# EAGLE design cherrymx1 (EAGLE 9.6.2)
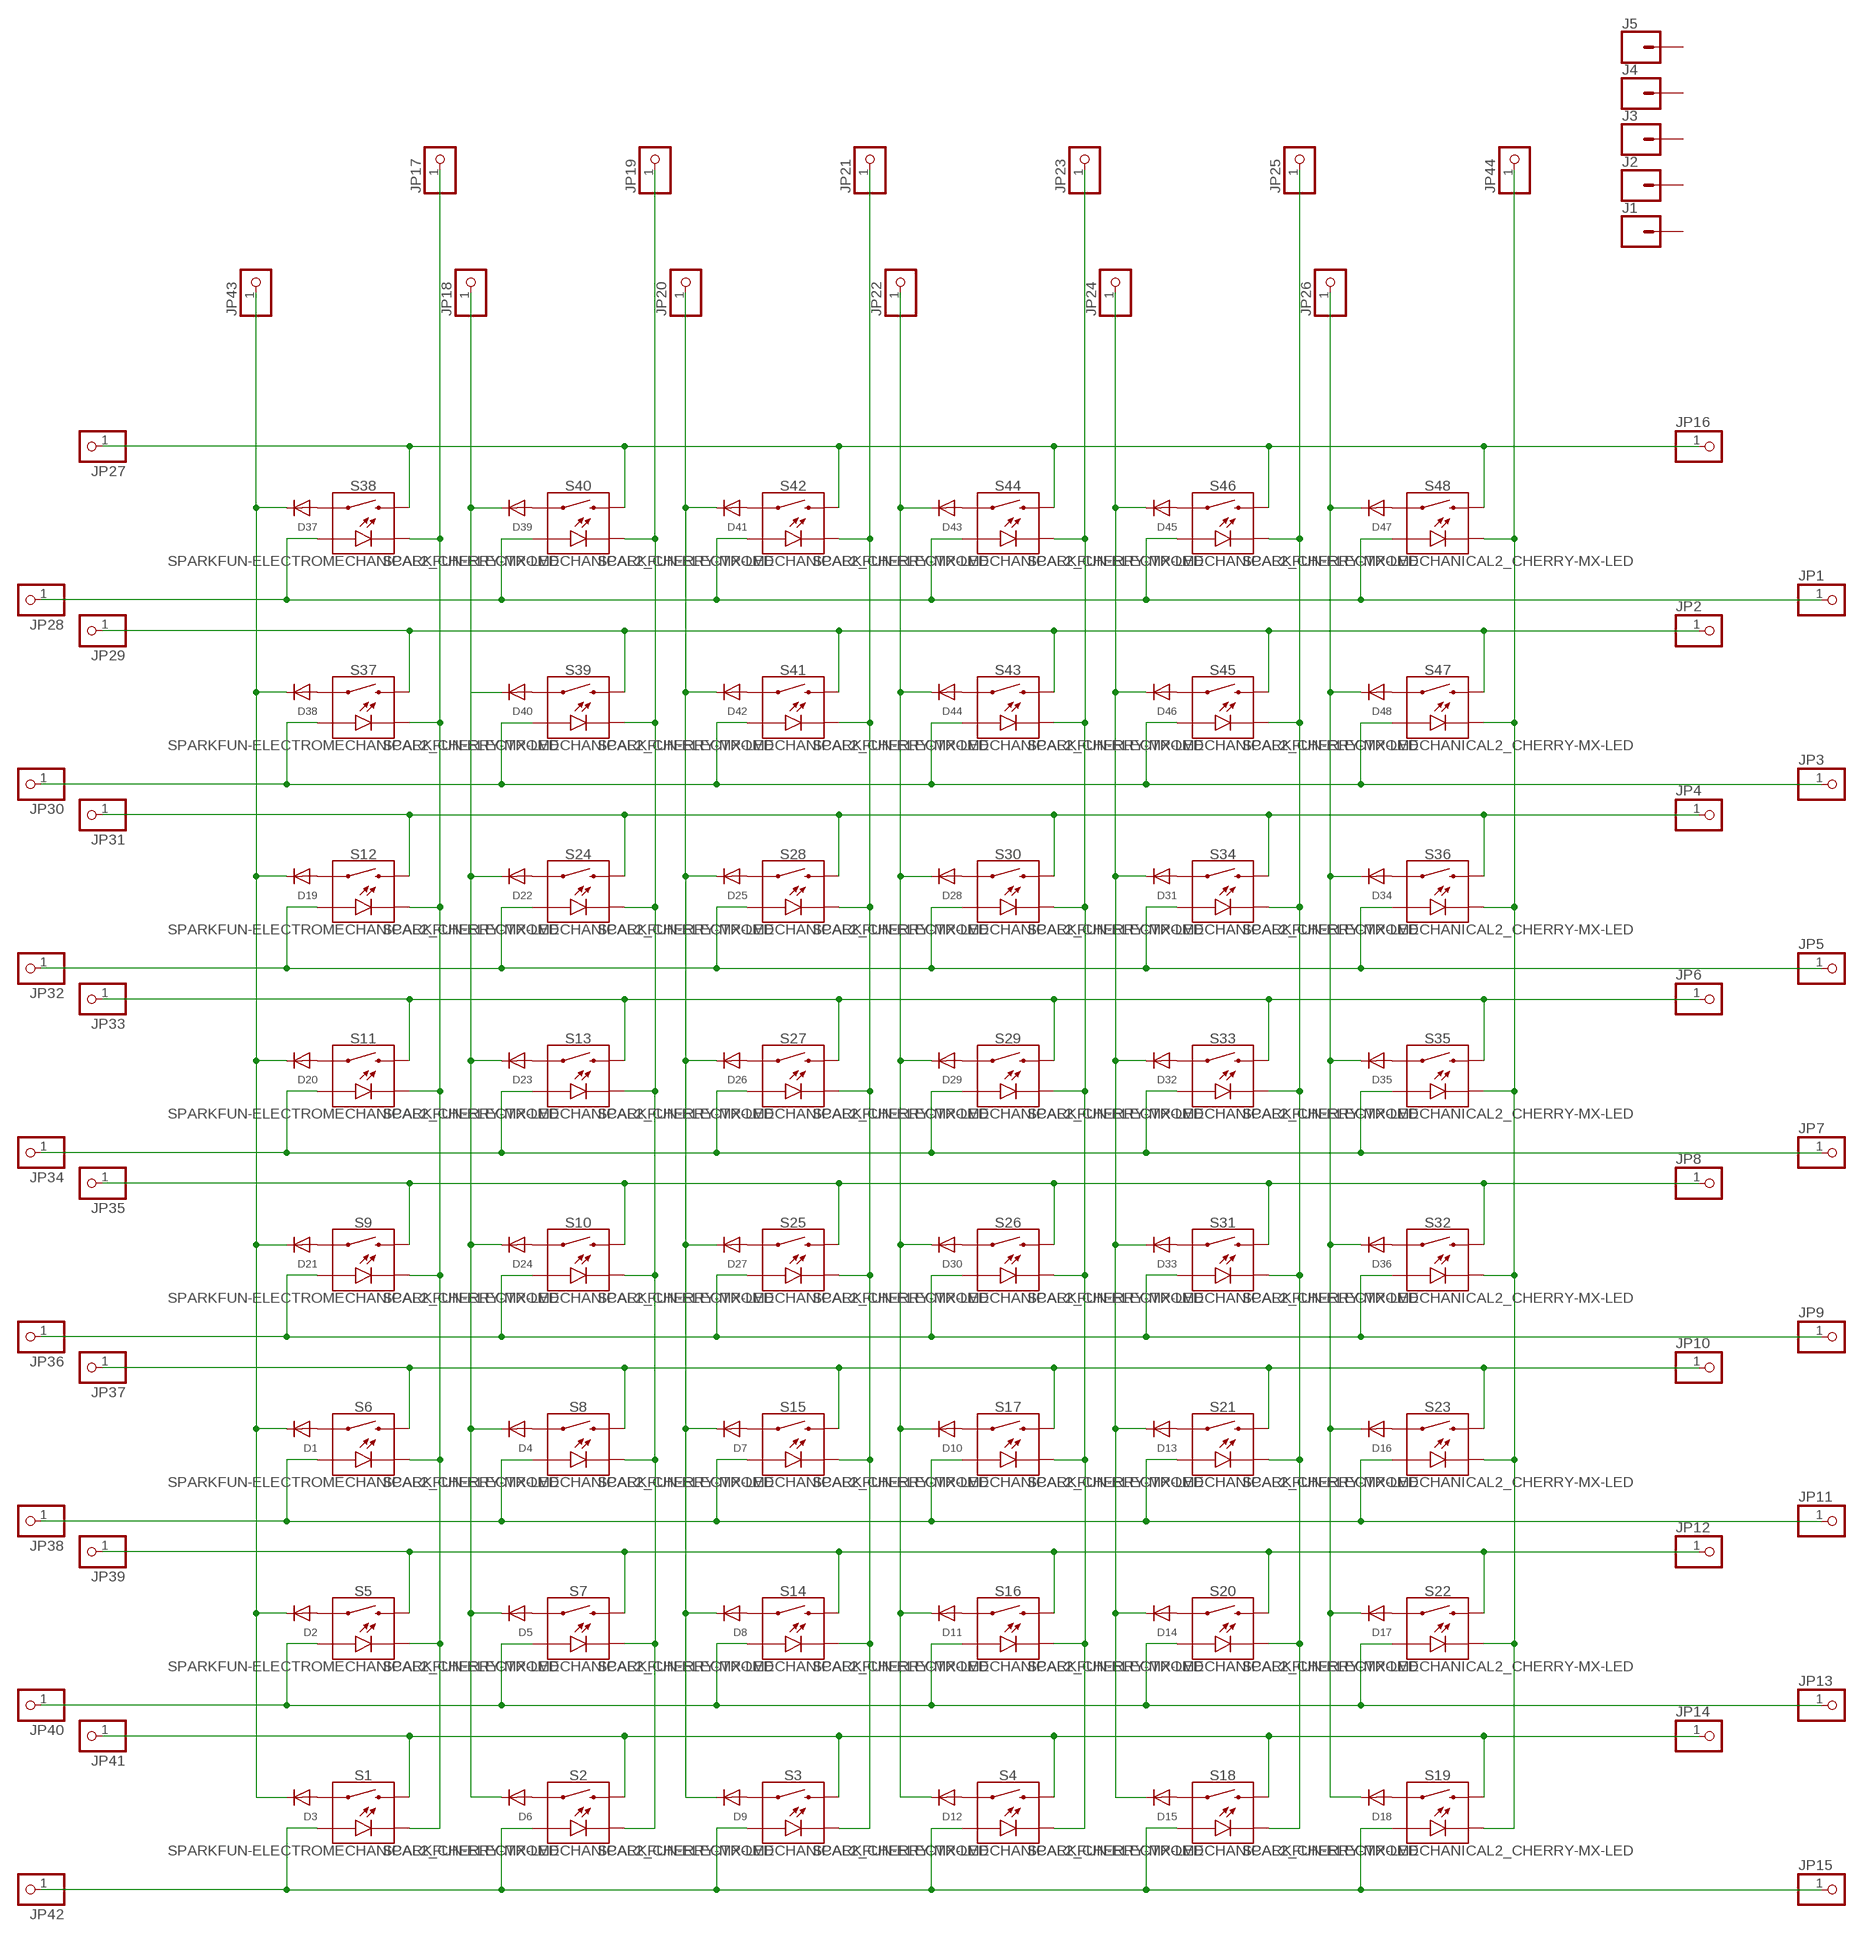
[diagram p0: schematic, sheet 1]

## Parts
D1  DIODE_SOD-123FL  [SOD-123FL]
D2  DIODE_SOD-123FL  [SOD-123FL]
D3  DIODE_SOD-123FL  [SOD-123FL]
D4  DIODE_SOD-123FL  [SOD-123FL]
D5  DIODE_SOD-123FL  [SOD-123FL]
D6  DIODE_SOD-123FL  [SOD-123FL]
D7  DIODE_SOD-123FL  [SOD-123FL]
D8  DIODE_SOD-123FL  [SOD-123FL]
D9  DIODE_SOD-123FL  [SOD-123FL]
D10  DIODE_SOD-123FL  [SOD-123FL]
D11  DIODE_SOD-123FL  [SOD-123FL]
D12  DIODE_SOD-123FL  [SOD-123FL]
D13  DIODE_SOD-123FL  [SOD-123FL]
D14  DIODE_SOD-123FL  [SOD-123FL]
D15  DIODE_SOD-123FL  [SOD-123FL]
D16  DIODE_SOD-123FL  [SOD-123FL]
D17  DIODE_SOD-123FL  [SOD-123FL]
D18  DIODE_SOD-123FL  [SOD-123FL]
D19  DIODE_SOD-123FL  [SOD-123FL]
D20  DIODE_SOD-123FL  [SOD-123FL]
D21  DIODE_SOD-123FL  [SOD-123FL]
D22  DIODE_SOD-123FL  [SOD-123FL]
D23  DIODE_SOD-123FL  [SOD-123FL]
D24  DIODE_SOD-123FL  [SOD-123FL]
D25  DIODE_SOD-123FL  [SOD-123FL]
D26  DIODE_SOD-123FL  [SOD-123FL]
D27  DIODE_SOD-123FL  [SOD-123FL]
D28  DIODE_SOD-123FL  [SOD-123FL]
D29  DIODE_SOD-123FL  [SOD-123FL]
D30  DIODE_SOD-123FL  [SOD-123FL]
D31  DIODE_SOD-123FL  [SOD-123FL]
D32  DIODE_SOD-123FL  [SOD-123FL]
D33  DIODE_SOD-123FL  [SOD-123FL]
D34  DIODE_SOD-123FL  [SOD-123FL]
D35  DIODE_SOD-123FL  [SOD-123FL]
D36  DIODE_SOD-123FL  [SOD-123FL]
D37  DIODE_SOD-123FL  [SOD-123FL]
D38  DIODE_SOD-123FL  [SOD-123FL]
D39  DIODE_SOD-123FL  [SOD-123FL]
D40  DIODE_SOD-123FL  [SOD-123FL]
D41  DIODE_SOD-123FL  [SOD-123FL]
D42  DIODE_SOD-123FL  [SOD-123FL]
D43  DIODE_SOD-123FL  [SOD-123FL]
D44  DIODE_SOD-123FL  [SOD-123FL]
D45  DIODE_SOD-123FL  [SOD-123FL]
D46  DIODE_SOD-123FL  [SOD-123FL]
D47  DIODE_SOD-123FL  [SOD-123FL]
D48  DIODE_SOD-123FL  [SOD-123FL]
J1  CONN_01SMTSO-256-ET-0.165DIA  [SMTSO-256-ET-0.165DIA]
J2  CONN_01SMTSO-256-ET-0.165DIA  [SMTSO-256-ET-0.165DIA]
J3  CONN_01SMTSO-256-ET-0.165DIA  [SMTSO-256-ET-0.165DIA]
J4  CONN_01SMTSO-256-ET-0.165DIA  [SMTSO-256-ET-0.165DIA]
J5  CONN_01SMTSO-256-ET-0.165DIA  [SMTSO-256-ET-0.165DIA]
JP1  MICROBUILDER_HEADER-1X51X1_EDGESMT  [MICROBUILDER_1X5_SMT]
JP2  MICROBUILDER_HEADER-1X51X1_EDGESMT  [MICROBUILDER_1X5_SMT]
JP3  MICROBUILDER_HEADER-1X51X1_EDGESMT  [MICROBUILDER_1X5_SMT]
JP4  MICROBUILDER_HEADER-1X51X1_EDGESMT  [MICROBUILDER_1X5_SMT]
JP5  MICROBUILDER_HEADER-1X51X1_EDGESMT  [MICROBUILDER_1X5_SMT]
JP6  MICROBUILDER_HEADER-1X51X1_EDGESMT  [MICROBUILDER_1X5_SMT]
JP7  MICROBUILDER_HEADER-1X51X1_EDGESMT  [MICROBUILDER_1X5_SMT]
JP8  MICROBUILDER_HEADER-1X51X1_EDGESMT  [MICROBUILDER_1X5_SMT]
JP9  MICROBUILDER_HEADER-1X51X1_EDGESMT  [MICROBUILDER_1X5_SMT]
JP10  MICROBUILDER_HEADER-1X51X1_EDGESMT  [MICROBUILDER_1X5_SMT]
JP11  MICROBUILDER_HEADER-1X51X1_EDGESMT  [MICROBUILDER_1X5_SMT]
JP12  MICROBUILDER_HEADER-1X51X1_EDGESMT  [MICROBUILDER_1X5_SMT]
JP13  MICROBUILDER_HEADER-1X51X1_EDGESMT  [MICROBUILDER_1X5_SMT]
JP14  MICROBUILDER_HEADER-1X51X1_EDGESMT  [MICROBUILDER_1X5_SMT]
JP15  MICROBUILDER_HEADER-1X51X1_EDGESMT  [MICROBUILDER_1X5_SMT]
JP16  MICROBUILDER_HEADER-1X51X1_EDGESMT  [MICROBUILDER_1X5_SMT]
JP17  MICROBUILDER_HEADER-1X51X1_EDGESMT  [MICROBUILDER_1X5_SMT]
JP18  MICROBUILDER_HEADER-1X51X1_EDGESMT  [MICROBUILDER_1X5_SMT]
JP19  MICROBUILDER_HEADER-1X51X1_EDGESMT  [MICROBUILDER_1X5_SMT]
JP20  MICROBUILDER_HEADER-1X51X1_EDGESMT  [MICROBUILDER_1X5_SMT]
JP21  MICROBUILDER_HEADER-1X51X1_EDGESMT  [MICROBUILDER_1X5_SMT]
JP22  MICROBUILDER_HEADER-1X51X1_EDGESMT  [MICROBUILDER_1X5_SMT]
JP23  MICROBUILDER_HEADER-1X51X1_EDGESMT  [MICROBUILDER_1X5_SMT]
JP24  MICROBUILDER_HEADER-1X51X1_EDGESMT  [MICROBUILDER_1X5_SMT]
JP25  MICROBUILDER_HEADER-1X51X1_EDGESMT  [MICROBUILDER_1X5_SMT]
JP26  MICROBUILDER_HEADER-1X51X1_EDGESMT  [MICROBUILDER_1X5_SMT]
JP27  MICROBUILDER_HEADER-1X51X1_EDGESMT  [MICROBUILDER_1X5_SMT]
JP28  MICROBUILDER_HEADER-1X51X1_EDGESMT  [MICROBUILDER_1X5_SMT]
JP29  MICROBUILDER_HEADER-1X51X1_EDGESMT  [MICROBUILDER_1X5_SMT]
JP30  MICROBUILDER_HEADER-1X51X1_EDGESMT  [MICROBUILDER_1X5_SMT]
JP31  MICROBUILDER_HEADER-1X51X1_EDGESMT  [MICROBUILDER_1X5_SMT]
JP32  MICROBUILDER_HEADER-1X51X1_EDGESMT  [MICROBUILDER_1X5_SMT]
JP33  MICROBUILDER_HEADER-1X51X1_EDGESMT  [MICROBUILDER_1X5_SMT]
JP34  MICROBUILDER_HEADER-1X51X1_EDGESMT  [MICROBUILDER_1X5_SMT]
JP35  MICROBUILDER_HEADER-1X51X1_EDGESMT  [MICROBUILDER_1X5_SMT]
JP36  MICROBUILDER_HEADER-1X51X1_EDGESMT  [MICROBUILDER_1X5_SMT]
JP37  MICROBUILDER_HEADER-1X51X1_EDGESMT  [MICROBUILDER_1X5_SMT]
JP38  MICROBUILDER_HEADER-1X51X1_EDGESMT  [MICROBUILDER_1X5_SMT]
JP39  MICROBUILDER_HEADER-1X51X1_EDGESMT  [MICROBUILDER_1X5_SMT]
JP40  MICROBUILDER_HEADER-1X51X1_EDGESMT  [MICROBUILDER_1X5_SMT]
JP41  MICROBUILDER_HEADER-1X51X1_EDGESMT  [MICROBUILDER_1X5_SMT]
JP42  MICROBUILDER_HEADER-1X51X1_EDGESMT  [MICROBUILDER_1X5_SMT]
JP43  MICROBUILDER_HEADER-1X51X1_EDGESMT  [MICROBUILDER_1X5_SMT]
JP44  MICROBUILDER_HEADER-1X51X1_EDGESMT  [MICROBUILDER_1X5_SMT]
S1  SPARKFUN-ELECTROMECHANICAL2_CHERRY-MX-LED  [SPARKFUN-ELECTROMECHANICAL2_CHERRY-MX-LED]
S2  SPARKFUN-ELECTROMECHANICAL2_CHERRY-MX-LED  [SPARKFUN-ELECTROMECHANICAL2_CHERRY-MX-LED]
S3  SPARKFUN-ELECTROMECHANICAL2_CHERRY-MX-LED  [SPARKFUN-ELECTROMECHANICAL2_CHERRY-MX-LED]
S4  SPARKFUN-ELECTROMECHANICAL2_CHERRY-MX-LED  [SPARKFUN-ELECTROMECHANICAL2_CHERRY-MX-LED]
S5  SPARKFUN-ELECTROMECHANICAL2_CHERRY-MX-LED  [SPARKFUN-ELECTROMECHANICAL2_CHERRY-MX-LED]
S6  SPARKFUN-ELECTROMECHANICAL2_CHERRY-MX-LED  [SPARKFUN-ELECTROMECHANICAL2_CHERRY-MX-LED]
S7  SPARKFUN-ELECTROMECHANICAL2_CHERRY-MX-LED  [SPARKFUN-ELECTROMECHANICAL2_CHERRY-MX-LED]
S8  SPARKFUN-ELECTROMECHANICAL2_CHERRY-MX-LED  [SPARKFUN-ELECTROMECHANICAL2_CHERRY-MX-LED]
S9  SPARKFUN-ELECTROMECHANICAL2_CHERRY-MX-LED  [SPARKFUN-ELECTROMECHANICAL2_CHERRY-MX-LED]
S10  SPARKFUN-ELECTROMECHANICAL2_CHERRY-MX-LED  [SPARKFUN-ELECTROMECHANICAL2_CHERRY-MX-LED]
S11  SPARKFUN-ELECTROMECHANICAL2_CHERRY-MX-LED  [SPARKFUN-ELECTROMECHANICAL2_CHERRY-MX-LED]
S12  SPARKFUN-ELECTROMECHANICAL2_CHERRY-MX-LED  [SPARKFUN-ELECTROMECHANICAL2_CHERRY-MX-LED]
S13  SPARKFUN-ELECTROMECHANICAL2_CHERRY-MX-LED  [SPARKFUN-ELECTROMECHANICAL2_CHERRY-MX-LED]
S14  SPARKFUN-ELECTROMECHANICAL2_CHERRY-MX-LED  [SPARKFUN-ELECTROMECHANICAL2_CHERRY-MX-LED]
S15  SPARKFUN-ELECTROMECHANICAL2_CHERRY-MX-LED  [SPARKFUN-ELECTROMECHANICAL2_CHERRY-MX-LED]
S16  SPARKFUN-ELECTROMECHANICAL2_CHERRY-MX-LED  [SPARKFUN-ELECTROMECHANICAL2_CHERRY-MX-LED]
S17  SPARKFUN-ELECTROMECHANICAL2_CHERRY-MX-LED  [SPARKFUN-ELECTROMECHANICAL2_CHERRY-MX-LED]
S18  SPARKFUN-ELECTROMECHANICAL2_CHERRY-MX-LED  [SPARKFUN-ELECTROMECHANICAL2_CHERRY-MX-LED]
S19  SPARKFUN-ELECTROMECHANICAL2_CHERRY-MX-LED  [SPARKFUN-ELECTROMECHANICAL2_CHERRY-MX-LED]
S20  SPARKFUN-ELECTROMECHANICAL2_CHERRY-MX-LED  [SPARKFUN-ELECTROMECHANICAL2_CHERRY-MX-LED]
S21  SPARKFUN-ELECTROMECHANICAL2_CHERRY-MX-LED  [SPARKFUN-ELECTROMECHANICAL2_CHERRY-MX-LED]
S22  SPARKFUN-ELECTROMECHANICAL2_CHERRY-MX-LED  [SPARKFUN-ELECTROMECHANICAL2_CHERRY-MX-LED]
S23  SPARKFUN-ELECTROMECHANICAL2_CHERRY-MX-LED  [SPARKFUN-ELECTROMECHANICAL2_CHERRY-MX-LED]
S24  SPARKFUN-ELECTROMECHANICAL2_CHERRY-MX-LED  [SPARKFUN-ELECTROMECHANICAL2_CHERRY-MX-LED]
S25  SPARKFUN-ELECTROMECHANICAL2_CHERRY-MX-LED  [SPARKFUN-ELECTROMECHANICAL2_CHERRY-MX-LED]
S26  SPARKFUN-ELECTROMECHANICAL2_CHERRY-MX-LED  [SPARKFUN-ELECTROMECHANICAL2_CHERRY-MX-LED]
S27  SPARKFUN-ELECTROMECHANICAL2_CHERRY-MX-LED  [SPARKFUN-ELECTROMECHANICAL2_CHERRY-MX-LED]
S28  SPARKFUN-ELECTROMECHANICAL2_CHERRY-MX-LED  [SPARKFUN-ELECTROMECHANICAL2_CHERRY-MX-LED]
S29  SPARKFUN-ELECTROMECHANICAL2_CHERRY-MX-LED  [SPARKFUN-ELECTROMECHANICAL2_CHERRY-MX-LED]
S30  SPARKFUN-ELECTROMECHANICAL2_CHERRY-MX-LED  [SPARKFUN-ELECTROMECHANICAL2_CHERRY-MX-LED]
S31  SPARKFUN-ELECTROMECHANICAL2_CHERRY-MX-LED  [SPARKFUN-ELECTROMECHANICAL2_CHERRY-MX-LED]
S32  SPARKFUN-ELECTROMECHANICAL2_CHERRY-MX-LED  [SPARKFUN-ELECTROMECHANICAL2_CHERRY-MX-LED]
S33  SPARKFUN-ELECTROMECHANICAL2_CHERRY-MX-LED  [SPARKFUN-ELECTROMECHANICAL2_CHERRY-MX-LED]
S34  SPARKFUN-ELECTROMECHANICAL2_CHERRY-MX-LED  [SPARKFUN-ELECTROMECHANICAL2_CHERRY-MX-LED]
S35  SPARKFUN-ELECTROMECHANICAL2_CHERRY-MX-LED  [SPARKFUN-ELECTROMECHANICAL2_CHERRY-MX-LED]
S36  SPARKFUN-ELECTROMECHANICAL2_CHERRY-MX-LED  [SPARKFUN-ELECTROMECHANICAL2_CHERRY-MX-LED]
S37  SPARKFUN-ELECTROMECHANICAL2_CHERRY-MX-LED  [SPARKFUN-ELECTROMECHANICAL2_CHERRY-MX-LED]
S38  SPARKFUN-ELECTROMECHANICAL2_CHERRY-MX-LED  [SPARKFUN-ELECTROMECHANICAL2_CHERRY-MX-LED]
S39  SPARKFUN-ELECTROMECHANICAL2_CHERRY-MX-LED  [SPARKFUN-ELECTROMECHANICAL2_CHERRY-MX-LED]
S40  SPARKFUN-ELECTROMECHANICAL2_CHERRY-MX-LED  [SPARKFUN-ELECTROMECHANICAL2_CHERRY-MX-LED]
S41  SPARKFUN-ELECTROMECHANICAL2_CHERRY-MX-LED  [SPARKFUN-ELECTROMECHANICAL2_CHERRY-MX-LED]
S42  SPARKFUN-ELECTROMECHANICAL2_CHERRY-MX-LED  [SPARKFUN-ELECTROMECHANICAL2_CHERRY-MX-LED]
S43  SPARKFUN-ELECTROMECHANICAL2_CHERRY-MX-LED  [SPARKFUN-ELECTROMECHANICAL2_CHERRY-MX-LED]
S44  SPARKFUN-ELECTROMECHANICAL2_CHERRY-MX-LED  [SPARKFUN-ELECTROMECHANICAL2_CHERRY-MX-LED]
S45  SPARKFUN-ELECTROMECHANICAL2_CHERRY-MX-LED  [SPARKFUN-ELECTROMECHANICAL2_CHERRY-MX-LED]
S46  SPARKFUN-ELECTROMECHANICAL2_CHERRY-MX-LED  [SPARKFUN-ELECTROMECHANICAL2_CHERRY-MX-LED]
S47  SPARKFUN-ELECTROMECHANICAL2_CHERRY-MX-LED  [SPARKFUN-ELECTROMECHANICAL2_CHERRY-MX-LED]
S48  SPARKFUN-ELECTROMECHANICAL2_CHERRY-MX-LED  [SPARKFUN-ELECTROMECHANICAL2_CHERRY-MX-LED]

## Nets
N$1: JP17.1 S1.K(C) S5.K(C) S6.K(C) S9.K(C) S11.K(C) S12.K(C) S37.K(C) S38.K(C)
N$3: D1.A S6.S1
N$4: JP11.1 JP38.1 S6.A S8.A S15.A S17.A S21.A S23.A
N$5: JP13.1 JP40.1 S5.A S7.A S14.A S16.A S20.A S22.A
N$6: JP15.1 JP42.1 S1.A S2.A S3.A S4.A S18.A S19.A
N$7: D2.A S5.S1
N$8: D3.A S1.S1
N$9: D4.A S8.S1
N$10: D5.A S7.S1
N$11: D6.A S2.S1
N$13: D4.C D5.C D6.C D22.C D23.C D24.C D39.C D40.C JP18.1
N$14: JP10.1 JP37.1 S6.S2 S8.S2 S15.S2 S17.S2 S21.S2 S23.S2
N$15: JP12.1 JP39.1 S5.S2 S7.S2 S14.S2 S16.S2 S20.S2 S22.S2
N$16: JP14.1 JP41.1 S1.S2 S2.S2 S3.S2 S4.S2 S18.S2 S19.S2
N$17: JP21.1 S3.K(C) S14.K(C) S15.K(C) S25.K(C) S27.K(C) S28.K(C) S41.K(C) S42.K(C)
N$18: JP23.1 S4.K(C) S16.K(C) S17.K(C) S26.K(C) S29.K(C) S30.K(C) S43.K(C) S44.K(C)
N$22: D7.A S15.S1
N$23: D8.A S14.S1
N$24: D9.A S3.S1
N$25: D10.A S17.S1
N$26: D11.A S16.S1
N$27: D12.A S4.S1
N$29: D10.C D11.C D12.C D28.C D29.C D30.C D43.C D44.C JP22.1
N$31: JP7.1 JP34.1 S11.A S13.A S27.A S29.A S33.A S35.A
N$32: JP9.1 JP36.1 S9.A S10.A S25.A S26.A S31.A S32.A
N$33: JP25.1 S18.K(C) S20.K(C) S21.K(C) S31.K(C) S33.K(C) S34.K(C) S45.K(C) S46.K(C)
N$36: D19.A S12.S1
N$37: D20.A S11.S1
N$38: D13.A S21.S1
N$39: D14.A S20.S1
N$40: D15.A S18.S1
N$41: D16.A S23.S1
N$42: D17.A S22.S1
N$43: D18.A S19.S1
N$44: D13.C D14.C D15.C D31.C D32.C D33.C D45.C D46.C JP24.1
N$45: D16.C D17.C D18.C D34.C D35.C D36.C D47.C D48.C JP26.1
N$46: D21.A S9.S1
N$47: D22.A S24.S1
N$48: D23.A S13.S1
N$49: D24.A S10.S1
N$52: JP4.1 JP31.1 S12.S2 S24.S2 S28.S2 S30.S2 S34.S2 S36.S2
N$53: JP6.1 JP33.1 S11.S2 S13.S2 S27.S2 S29.S2 S33.S2 S35.S2
N$54: JP8.1 JP35.1 S9.S2 S10.S2 S25.S2 S26.S2 S31.S2 S32.S2
N$57: JP5.1 JP32.1 S12.A S24.A S28.A S30.A S34.A S36.A
N$58: D25.A S28.S1
N$59: D26.A S27.S1
N$60: D27.A S25.S1
N$61: D28.A S30.S1
N$62: D29.A S29.S1
N$63: D30.A S26.S1
N$64: D7.C D8.C D9.C D25.C D26.C D27.C D41.C D42.C JP20.1
N$69: D31.A S34.S1
N$70: D32.A S33.S1
N$71: D33.A S31.S1
N$72: D34.A S36.S1
N$73: D35.A S35.S1
N$74: D36.A S32.S1
N$78: JP19.1 S2.K(C) S7.K(C) S8.K(C) S10.K(C) S13.K(C) S24.K(C) S39.K(C) S40.K(C)
N$79: JP1.1 JP28.1 S38.A S40.A S42.A S44.A S46.A S48.A
N$80: JP3.1 JP30.1 S37.A S39.A S41.A S43.A S45.A S47.A
N$81: D37.A S38.S1
N$82: D38.A S37.S1
N$83: D39.A S40.S1
N$84: D40.A S39.S1
N$85: D1.C D2.C D3.C D19.C D20.C D21.C D37.C D38.C JP43.1
N$87: JP16.1 JP27.1 S38.S2 S40.S2 S42.S2 S44.S2 S46.S2 S48.S2
N$88: JP2.1 JP29.1 S37.S2 S39.S2 S41.S2 S43.S2 S45.S2 S47.S2
N$92: D41.A S42.S1
N$93: D42.A S41.S1
N$94: D43.A S44.S1
N$95: D44.A S43.S1
N$99: JP44.1 S19.K(C) S22.K(C) S23.K(C) S32.K(C) S35.K(C) S36.K(C) S47.K(C) S48.K(C)
N$101: D45.A S46.S1
N$102: D46.A S45.S1
N$103: D47.A S48.S1
N$104: D48.A S47.S1
Unconnected: J1.P$1 J2.P$1 J3.P$1 J4.P$1 J5.P$1

## Library data of the parts
D1-D48 = adafruit:DIODE: Diode SMADIODE - SMA Surface Mount Package 20V 1A Schottky Diode Digikey: 641-1014-6-ND DO-1N4148 - Through Hole Small Current Diode SOD-123 20V 1 A (.5mV Vf) Schottky Diode - Digikey: MBRX120TPMSCT-ND SOD-323 10V 570mA (.38mV Vf, 3ns) Schottky Diode - Digikey: ZLLS410CT-ND SOD-523 30V 30mA Schottky Diode (RB751S-40TE61) - Digikey: RB751S-40TE61CT-ND SOT23-R/W - SOT23 Package (R = Solder Paste/Reflow Ovens, W = Hand-Soldering) BAT54Film 40V 300mA - Digikey: 497-7162-1-ND
J1-J5 = SparkFun-Connectors:CONN_01: Single connection point. Often used as Generic Header-pin footprint for 0.1 inch spaced/style header connections On any of the 0.1 inch spaced packages, you can populate with these: Break Away Headers - Straight <https://www.sparkfun.com/products/116> (PRT-00116) Break Away Male Headers - Right Angle <https://www.sparkfun.com/products/553> (PRT-00553) Female Headers <https://www.sparkfun.com/products/115> (PRT-00115) Break Away Headers - Machine Pin <https://www.sparkfun.com/products/117> (PRT-00117) Break Away Female Headers - Swiss Machine Pin <https://www.sparkfun.com/products/743> (PRT-00743) This device is also useful as a general connection point to wire up your design to another part of your project. Our various solder wires solder well into these plated through hole pads. Hook-Up Wire - Assortment (Stranded, 22 AWG) <https://www.sparkfun.com/products/11375> (PRT-11375) Hook-Up Wire - Assortment (Solid Core, 22 AWG) <https://www.sparkfun.com/products/11367> (PRT-11367) View the entire wire category on our website here <https://www.sparkfun.com/categories/141> Special notes: SMTSO-256-ET is a "flush mount" nut for a 4-40 screw. We mostly use this on specialty testbeds; it is a nice way to connect hardware to your PCB at an adjustable hieght. Also note, the SNAP packages are for using a snappable style connector. We sell a baggie of snaps and they are also used on two LilyPad designs: Snap Assortment - 30 pack (male and female) <https://www.sparkfun.com/products/11347> (DEV-11347) LilyPad Arduino SimpleSnap <https://www.sparkfun.com/products/10941> (DEV-10941) LilyPad SimpleSnap Protoboard <https://www.sparkfun.com/products/10940> (DEV-10940); PROD_ID: HW-08694
JP1-JP44 = microbuilder:MICROBUILDER_HEADER-1X5: PIN HEADER
S1-S48 = cherrymx1:SPARKFUN-ELECTROMECHANICAL2_CHERRY-MX-LED: Cherry MX Switch - Electromechanical Swith w/ LED Cherry MX Keyswitches are top-of-the-line mechanical keyboard switches. They’re satisfyingly “clicky”, reliable up to tens-of-millions of key presses, and a standard in gaming and programming keyboards across the globe. This ‘blue’ version Cherry MX Switch is favored by most due to its secondary internal actuator making it less likely to “double-tap.” If you are looking for a noticeably audible and high-quality key switch, this is the perfect option for you! SparkFun Product Link <https://www.sparkfun.com/products/13834>; SF_ID: COM-13834

## Board
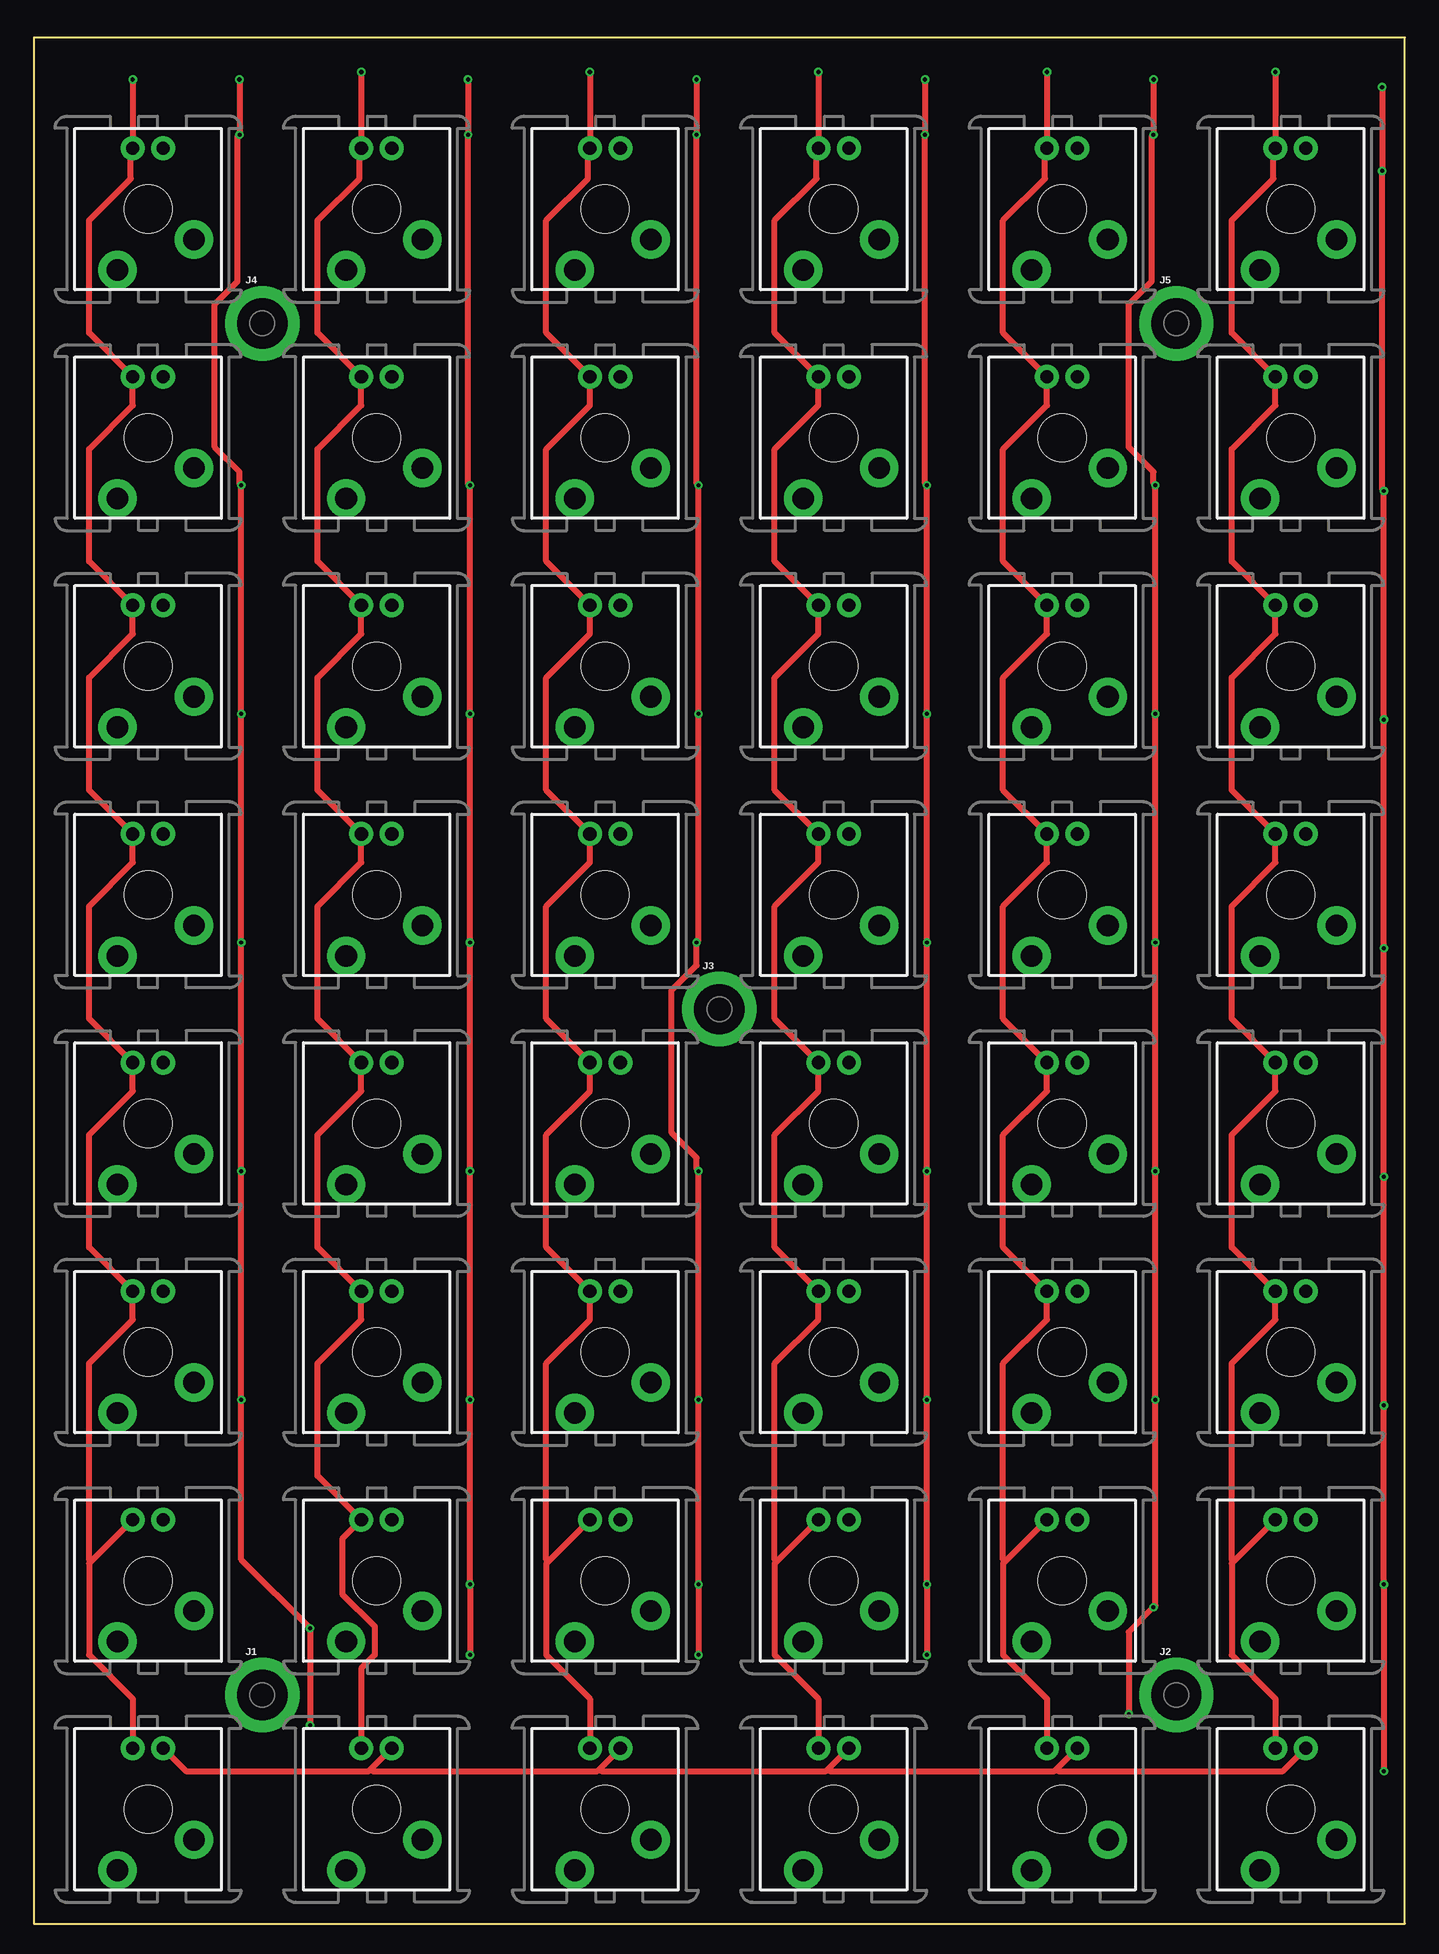
[diagram p1: board, top side]
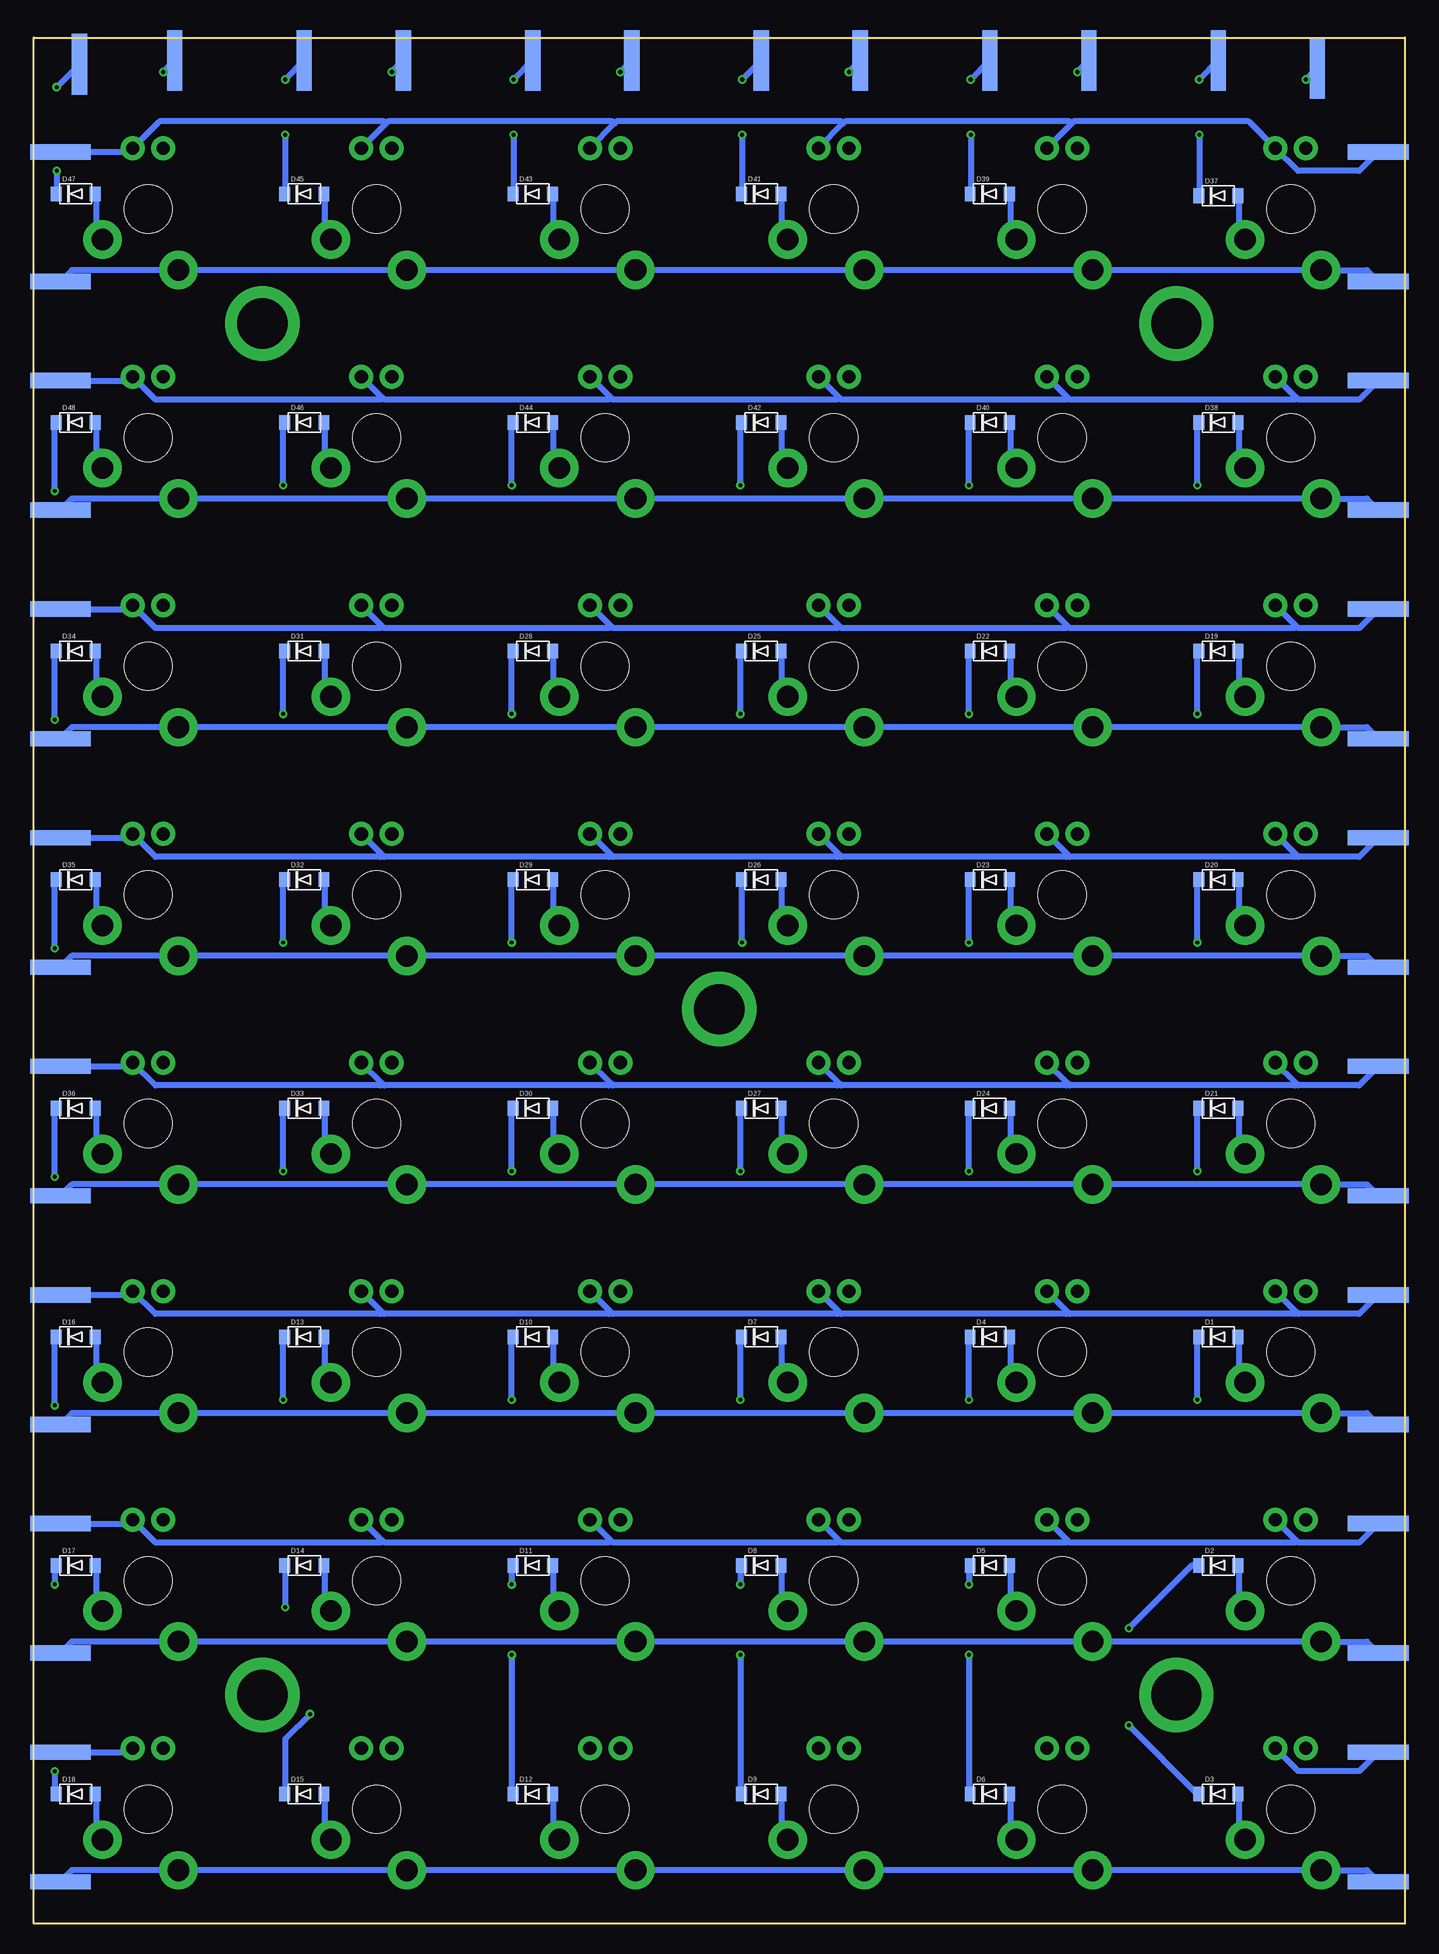
[diagram p2: board, bottom side, seen from below]

Size 114.3 x 157.16 mm. Coordinates in mm from the lower left corner, seen from the top.
Outline: 0,0 114.3,0 114.3,157.16 0,157.16 0,0
Copper layers (1*16): Top 0.0356mm / dielectric 1.5011mm / Bottom 0.0356mm
Design rules "oshpark-2layer *": minimum track width 20mil, minimum drill 13mil, track to track 20mil, track to pad 20mil, pad to pad 20mil, via to via 20mil, smd to smd 20mil, copper to edge 20mil, drill to drill 20mil, minimum pad ring 7mil, minimum via ring 7mil, stop-mask expansion 4mil, vias tented up to drill 20mil, thermal gap 10mil

### Footprints (pad centres in the part's own frame; a part is rotated, then mirrored left to right if it is on the bottom)
SOD-123FL = smd 0.91 x 1.22: A 1.637,0; C -1.637,0
SMTSO-256-ET-0.165DIA = drill 4.191 pad 6.198: P$1 0,0
MICROBUILDER_1X5_SMT = smd 1.27 x 5.08: 1 0,0
SPARKFUN-ELECTROMECHANICAL2_CHERRY-MX-LED = drill 1.1 pad 2: A -1.27,-5.08; K 1.27,-5.08 | drill 1.8 pad 3.2: S1 -3.81,2.54; S2 2.54,5.08 | hole 4: 0,0

### Placement (x,y rotation side)
D1  15.56,48.9 0 bottom
D2  15.56,29.84 0 bottom
D3  15.56,10.79 0 bottom
D4  34.61,48.9 0 bottom
D5  34.61,29.84 0 bottom
D6  34.61,10.79 0 bottom
D7  53.66,48.9 0 bottom
D8  53.66,29.84 0 bottom
D9  53.66,10.79 0 bottom
D10  72.71,48.9 0 bottom
D11  72.71,29.84 0 bottom
D12  72.71,10.79 0 bottom
D13  91.76,48.9 0 bottom
D14  91.76,29.84 0 bottom
D15  91.76,10.79 0 bottom
D16  110.81,48.9 0 bottom
D17  110.81,29.84 0 bottom
D18  110.81,10.79 0 bottom
D19  15.56,106.05 0 bottom
D20  15.56,87 0 bottom
D21  15.56,67.94 0 bottom
D22  34.61,106.05 0 bottom
D23  34.61,87 0 bottom
D24  34.61,67.94 0 bottom
D25  53.66,106.05 0 bottom
D26  53.66,87 0 bottom
D27  53.66,67.94 0 bottom
D28  72.71,106.05 0 bottom
D29  72.71,87 0 bottom
D30  72.71,67.94 0 bottom
D31  91.76,106.05 0 bottom
D32  91.76,87 0 bottom
D33  91.76,67.94 0 bottom
D34  110.81,106.05 0 bottom
D35  110.81,87 0 bottom
D36  110.81,67.94 0 bottom
D37  15.56,143.99 0 bottom
D38  15.56,125.09 0 bottom
D39  34.61,144.15 0 bottom
D40  34.61,125.09 0 bottom
D41  53.66,144.15 0 bottom
D42  53.66,125.09 0 bottom
D43  72.71,144.15 0 bottom
D44  72.71,125.09 0 bottom
D45  91.76,144.15 0 bottom
D46  91.76,125.09 0 bottom
D47  110.81,144.15 0 bottom
D48  110.81,125.09 0 bottom
J1  19.05,19.05 0 top
J2  95.25,19.05 0 top
J3  57.15,76.2 0 top
J4  19.05,133.35 0 top
J5  95.25,133.35 0 top
JP1  112.08,147.64 270 bottom
JP2  112.08,117.79 270 bottom
JP3  112.08,128.59 270 bottom
JP4  112.08,98.74 270 bottom
JP5  112.08,109.54 270 bottom
JP6  112.08,79.69 270 bottom
JP7  112.08,90.49 270 bottom
JP8  112.08,60.64 270 bottom
JP9  112.08,71.44 270 bottom
JP10  112.08,41.59 270 bottom
JP11  112.08,52.39 270 bottom
JP12  112.08,22.54 270 bottom
JP13  112.08,33.34 270 bottom
JP14  112.08,3.49 270 bottom
JP15  112.08,14.29 270 bottom
JP16  112.08,136.84 270 bottom
JP17  7.3,154.62 0 bottom
JP18  34.61,155.26 0 bottom
JP19  26.35,155.26 0 bottom
JP20  53.66,155.26 0 bottom
JP21  45.4,155.26 0 bottom
JP22  72.71,155.26 0 bottom
JP23  64.45,155.26 180 bottom
JP24  91.76,155.26 0 bottom
JP25  83.5,155.26 180 bottom
JP26  110.49,154.94 180 bottom
JP27  2.22,136.84 270 bottom
JP28  2.22,147.64 270 bottom
JP29  2.22,117.79 270 bottom
JP30  2.22,128.59 270 bottom
JP31  2.22,98.74 270 bottom
JP32  2.22,109.54 270 bottom
JP33  2.22,79.69 270 bottom
JP34  2.22,90.49 270 bottom
JP35  2.22,60.64 270 bottom
JP36  2.22,71.44 270 bottom
JP37  2.22,41.59 270 bottom
JP38  2.22,52.39 270 bottom
JP39  2.22,22.54 270 bottom
JP40  2.22,33.34 270 bottom
JP41  2.22,3.49 270 bottom
JP42  2.22,14.29 270 bottom
JP43  15.56,155.26 0 bottom
JP44  102.55,155.26 0 bottom
S1  9.53,9.53 180 top
S2  28.57,9.53 180 top
S3  47.62,9.53 180 top
S4  66.67,9.53 180 top
S5  9.53,28.57 180 top
S6  9.53,47.62 180 top
S7  28.57,28.57 180 top
S8  28.57,47.62 180 top
S9  9.53,66.67 180 top
S10  28.57,66.67 180 top
S11  9.53,85.72 180 top
S12  9.53,104.78 180 top
S13  28.57,85.72 180 top
S14  47.62,28.57 180 top
S15  47.62,47.62 180 top
S16  66.67,28.57 180 top
S17  66.67,47.62 180 top
S18  85.72,9.53 180 top
S19  104.78,9.53 180 top
S20  85.72,28.57 180 top
S21  85.72,47.62 180 top
S22  104.78,28.57 180 top
S23  104.78,47.62 180 top
S24  28.57,104.78 180 top
S25  47.62,66.67 180 top
S26  66.67,66.67 180 top
S27  47.62,85.72 180 top
S28  47.62,104.78 180 top
S29  66.67,85.72 180 top
S30  66.67,104.78 180 top
S31  85.72,66.67 180 top
S32  104.78,66.67 180 top
S33  85.72,85.72 180 top
S34  85.72,104.78 180 top
S35  104.78,85.72 180 top
S36  104.78,104.78 180 top
S37  9.53,123.83 180 top
S38  9.53,142.88 180 top
S39  28.57,123.83 180 top
S40  28.57,142.88 180 top
S41  47.62,123.83 180 top
S42  47.62,142.88 180 top
S43  66.67,123.83 180 top
S44  66.67,142.88 180 top
S45  85.72,123.83 180 top
S46  85.72,142.88 180 top
S47  104.78,123.83 180 top
S48  104.78,142.88 180 top

### Tracks (layer width: path | path; a pad name or v marks a point on that pad's centre or on a via)
N$1  (via drill 0.35)
  Top 0.508: v8.26,153.67 S38.K 8.1,147.8 8.1,145.41 4.6,141.92 4.6,132.56 S37.K 8.26,126.52 4.6,122.87 4.6,113.51 S12.K 8.26,107.47 4.6,103.82 4.6,94.46 S11.K 8.26,88.42 4.6,84.77 4.6,75.41 S9.K 8.26,69.37 4.6,65.72 4.6,56.36 S6.K 8.26,50.32 4.6,46.67 4.6,30.32 4.76,30.16 | S1.K 8.26,18.73 4.6,22.38 4.6,30 4.76,30.16 | S5.K 4.76,30.16
  Bottom 0.508: JP17.1 v8.26,153.67
N$3
  Bottom 0.508: S6.S1 13.81,45.09 13.81,48.9 D1.A
N$4
  Bottom 0.508: JP11.1 106.36,52.39 S23.A 104.14,50.8 85.41,50.8 85.25,50.96 | 9.05,50.96 8.89,50.8 3.81,50.8 JP38.1 | 9.05,50.96 S6.A | 28.1,50.96 27.94,50.8 9.21,50.8 9.05,50.96 | 28.1,50.96 S8.A | 47.15,50.96 46.99,50.8 28.26,50.8 28.1,50.96 | 47.15,50.96 S15.A | 66.2,50.96 66.04,50.8 47.31,50.8 47.15,50.96 | 66.2,50.96 S17.A | 85.25,50.96 85.09,50.8 66.36,50.8 66.2,50.96 | 85.25,50.96 S21.A
N$5
  Bottom 0.508: JP13.1 106.36,33.34 S22.A 104.14,31.75 85.41,31.75 85.25,31.91 | 9.05,31.91 8.89,31.75 3.81,31.75 JP40.1 | 9.05,31.91 S5.A | 28.1,31.91 27.94,31.75 9.21,31.75 9.05,31.91 | 28.1,31.91 S7.A | 47.15,31.91 46.99,31.75 28.26,31.75 28.1,31.91 | 47.15,31.91 S14.A | 66.2,31.91 66.04,31.75 47.31,31.75 47.15,31.91 | 66.2,31.91 S16.A | 85.25,31.91 85.09,31.75 66.36,31.75 66.2,31.91 | 85.25,31.91 S20.A
N$6
  Top 0.508: 28.1,12.86 27.94,12.7 12.7,12.7 S1.A | 28.1,12.86 S2.A | 47.15,12.86 46.99,12.7 28.26,12.7 28.1,12.86 | 47.15,12.86 S3.A | 66.2,12.86 66.04,12.7 47.31,12.7 47.15,12.86 | 66.2,12.86 S4.A | 85.25,12.86 85.09,12.7 66.36,12.7 66.2,12.86 | 85.25,12.86 S18.A | S19.A 104.14,12.7 85.41,12.7 85.25,12.86
  Bottom 0.508: S19.A 106.36,14.29 JP15.1 | S1.A 8.89,12.7 3.81,12.7 JP42.1
N$7
  Bottom 0.508: S5.S1 13.81,26.04 13.81,29.84 D2.A
N$8
  Bottom 0.508: S1.S1 13.81,6.99 13.81,10.79 D3.A
N$9
  Bottom 0.508: S8.S1 32.86,45.09 32.86,48.9 D4.A
N$10
  Bottom 0.508: S7.S1 32.86,26.04 32.86,29.84 D5.A
N$11
  Bottom 0.508: S2.S1 32.86,6.99 32.86,10.79 D6.A
N$13  (via drill 0.33, 0.35)
  Top 0.508: v36.2,153.67 v36.2,149.07 36.2,120.02 v36.35,119.86 v36.35,100.81 v36.35,81.76 v36.35,62.71 v36.35,43.66 v36.35,28.26 v36.35,22.38
  Bottom 0.508: v36.2,149.07 36.2,144.15 D39.C | JP18.1 v36.2,153.67 | v36.35,22.38 36.35,10.79 D6.C | v36.35,28.26 36.35,29.84 D5.C | v36.35,43.66 36.35,48.9 D4.C | v36.35,62.71 36.35,67.94 D24.C | v36.35,81.76 36.35,87 D23.C | v36.35,100.81 36.35,106.05 D22.C | v36.35,119.86 36.35,125.09 D40.C
N$14
  Bottom 0.508: JP10.1 111.12,42.55 S23.S2 S21.S2 S17.S2 S15.S2 S8.S2 S6.S2 3.17,42.55 JP37.1
N$15
  Bottom 0.508: JP12.1 111.12,23.5 S22.S2 S20.S2 S16.S2 S14.S2 S7.S2 S5.S2 3.17,23.5 JP39.1
N$16
  Bottom 0.508: JP14.1 111.12,4.45 S19.S2 S18.S2 S4.S2 S3.S2 S2.S2 S1.S2 3.17,4.45 JP41.1
N$17  (via drill 0.35)
  Top 0.508: v46.35,154.31 S42.K 46.2,147.8 46.2,145.41 42.7,141.92 42.7,132.56 S41.K 46.35,126.52 42.7,122.87 42.7,113.51 S28.K 46.35,107.47 42.7,103.82 42.7,94.46 S27.K 46.35,88.42 42.7,84.77 42.7,75.41 S25.K 46.35,69.37 42.7,65.72 42.7,56.36 S15.K 46.35,50.32 42.7,46.67 42.7,30.32 42.86,30.16 | S3.K 46.35,18.73 42.7,22.38 42.7,30 42.86,30.16 | S14.K 42.86,30.16
  Bottom 0.508: JP21.1 v46.35,154.31
N$18  (via drill 0.35)
  Top 0.508: v65.41,154.31 S44.K 65.25,147.8 65.25,145.41 61.75,141.92 61.75,132.56 S43.K 65.41,126.52 61.75,122.87 61.75,113.51 S30.K 65.41,107.47 61.75,103.82 61.75,94.46 S29.K 65.41,88.42 61.75,84.77 61.75,75.41 S26.K 65.41,69.37 61.75,65.72 61.75,56.36 S17.K 65.41,50.32 61.75,46.67 61.75,30.32 61.91,30.16 | S4.K 65.41,18.73 61.75,22.38 61.75,30 61.91,30.16 | S16.K 61.91,30.16
  Bottom 0.508: JP23.1 v65.41,154.31
N$22
  Bottom 0.508: S15.S1 51.91,45.09 51.91,48.9 D7.A
N$23
  Bottom 0.508: S14.S1 51.91,26.04 51.91,29.84 D8.A
N$24
  Bottom 0.508: S3.S1 51.91,6.99 51.91,10.79 D9.A
N$25
  Bottom 0.508: S17.S1 70.96,45.09 70.96,48.9 D10.A
N$26
  Bottom 0.508: S16.S1 70.96,26.04 70.96,29.84 D11.A
N$27
  Bottom 0.508: S4.S1 70.96,6.99 70.96,10.79 D12.A
N$29  (via drill 0.33, 0.35)
  Top 0.508: v74.3,153.67 v74.3,149.07 74.3,120.02 v74.45,119.86 v74.45,100.81 v74.45,81.76 v74.45,62.71 v74.45,43.66 v74.45,28.26 v74.45,22.38
  Bottom 0.508: v74.3,149.07 74.3,144.15 D43.C | JP22.1 v74.3,153.67 | v74.45,22.38 74.45,10.79 D12.C | v74.45,28.26 74.45,29.84 D11.C | v74.45,43.66 74.45,48.9 D10.C | v74.45,62.71 74.45,67.94 D30.C | v74.45,81.76 74.45,87 D29.C | v74.45,100.81 74.45,106.05 D28.C | v74.45,119.86 74.45,125.09 D44.C
N$31
  Bottom 0.508: JP7.1 106.36,90.49 S35.A 104.14,88.9 85.41,88.9 85.25,89.06 | 9.05,89.06 8.89,88.9 3.81,88.9 JP34.1 | 9.05,89.06 S11.A | 28.1,89.06 27.94,88.9 9.21,88.9 9.05,89.06 | 28.1,89.06 S13.A | 47.15,89.06 46.99,88.9 28.26,88.9 28.1,89.06 | 47.15,89.06 S27.A | 66.2,89.06 66.04,88.9 47.31,88.9 47.15,89.06 | 66.2,89.06 S29.A | 85.25,89.06 85.09,88.9 66.36,88.9 66.2,89.06 | 85.25,89.06 S33.A
N$32
  Bottom 0.508: JP9.1 106.36,71.44 S32.A 104.14,69.85 85.41,69.85 85.25,70.01 | 9.05,70.01 8.89,69.85 3.81,69.85 JP36.1 | 9.05,70.01 S9.A | 28.1,70.01 27.94,69.85 9.21,69.85 9.05,70.01 | 28.1,70.01 S10.A | 47.15,70.01 46.99,69.85 28.26,69.85 28.1,70.01 | 47.15,70.01 S25.A | 66.2,70.01 66.04,69.85 47.31,69.85 47.15,70.01 | 66.2,70.01 S26.A | 85.25,70.01 85.09,69.85 66.36,69.85 66.2,70.01 | 85.25,70.01 S31.A
N$33  (via drill 0.35)
  Top 0.508: v84.45,154.31 S46.K 84.3,147.8 84.3,145.41 80.8,141.92 80.8,132.56 S45.K 84.45,126.52 80.8,122.87 80.8,113.51 S34.K 84.45,107.47 80.8,103.82 80.8,94.46 S33.K 84.45,88.42 80.8,84.77 80.8,75.41 S31.K 84.45,69.37 80.8,65.72 80.8,56.36 S21.K 84.45,50.32 80.8,46.67 80.8,30.32 80.96,30.16 | S18.K 84.45,18.73 80.8,22.38 80.8,30 80.96,30.16 | S20.K 80.96,30.16
  Bottom 0.508: JP25.1 v84.45,154.31
N$36
  Bottom 0.508: S12.S1 13.81,102.23 13.81,106.05 D19.A
N$37
  Bottom 0.508: S11.S1 13.81,83.19 13.81,87 D20.A
N$38
  Bottom 0.508: S21.S1 90.01,45.09 90.01,48.9 D13.A
N$39
  Bottom 0.508: S20.S1 90.01,26.04 90.01,29.84 D14.A
N$40
  Bottom 0.508: S18.S1 90.01,6.99 90.01,10.79 D15.A
N$41
  Bottom 0.508: S23.S1 109.06,45.09 109.06,48.9 D16.A
N$42
  Bottom 0.508: S22.S1 109.06,26.04 109.06,29.84 D17.A
N$43
  Bottom 0.508: S19.S1 109.06,6.99 109.06,10.79 D18.A
N$44  (via drill 0.33, 0.35)
  Top 0.508: v93.34,153.67 v93.34,149.07 93.19,148.91 93.19,136.84 91.28,134.94 91.28,123.03 93.34,120.97 93.34,120.02 v93.5,119.86 v93.5,100.81 v93.5,81.76 v93.5,62.71 v93.5,43.66 93.5,26.51 v93.34,26.35 91.28,24.29 v91.28,17.46
  Bottom 0.508: v93.34,149.07 93.34,144.15 D45.C | JP24.1 v93.34,153.67 | v91.28,17.46 93.34,15.4 93.34,10.79 D15.C | v93.34,26.35 93.34,29.84 D14.C | v93.5,43.66 93.5,48.9 D13.C | v93.5,62.71 93.5,67.94 D33.C | v93.5,81.76 93.5,87 D32.C | v93.5,100.81 93.5,106.05 D31.C | v93.5,119.86 93.5,125.09 D46.C
N$45  (via drill 0.33, 0.35)
  Top 0.508: v112.39,153.03 v112.39,146.05 112.39,119.54 v112.55,119.38 v112.55,100.33 v112.55,81.28 v112.55,62.23 v112.55,43.18 v112.55,28.26 v112.55,12.7
  Bottom 0.508: v112.39,146.05 112.39,144.15 D47.C | JP26.1 v112.39,153.03 | v112.55,12.7 112.55,10.79 D18.C | v112.55,28.26 112.55,29.84 D17.C | v112.55,43.18 112.55,48.9 D16.C | v112.55,62.23 112.55,67.94 D36.C | v112.55,81.28 112.55,87 D35.C | v112.55,100.33 112.55,106.05 D34.C | v112.55,119.38 112.55,125.09 D48.C
N$46
  Bottom 0.508: S9.S1 13.81,64.14 13.81,67.94 D21.A
N$47
  Bottom 0.508: S24.S1 32.86,102.23 32.86,106.05 D22.A
N$48
  Bottom 0.508: S13.S1 32.86,83.19 32.86,87 D23.A
N$49
  Bottom 0.508: S10.S1 32.86,64.14 32.86,67.94 D24.A
N$52
  Bottom 0.508: JP4.1 111.12,99.69 S36.S2 S34.S2 S30.S2 S28.S2 S24.S2 S12.S2 3.17,99.69 JP31.1
N$53
  Bottom 0.508: JP6.1 111.12,80.64 S35.S2 S33.S2 S29.S2 S27.S2 S13.S2 S11.S2 3.17,80.64 JP33.1
N$54
  Bottom 0.508: JP8.1 111.12,61.59 S32.S2 S31.S2 S26.S2 S25.S2 S10.S2 S9.S2 3.17,61.59 JP35.1
N$57
  Bottom 0.508: JP5.1 106.36,109.54 S36.A 104.14,107.95 85.41,107.95 85.25,108.11 | 9.05,108.11 8.89,107.95 3.81,107.95 JP32.1 | 9.05,108.11 S12.A | 28.1,108.11 27.94,107.95 9.21,107.95 9.05,108.11 | 28.1,108.11 S24.A | 47.15,108.11 46.99,107.95 28.26,107.95 28.1,108.11 | 47.15,108.11 S28.A | 66.2,108.11 66.04,107.95 47.31,107.95 47.15,108.11 | 66.2,108.11 S30.A | 85.25,108.11 85.09,107.95 66.36,107.95 66.2,108.11 | 85.25,108.11 S34.A
N$58
  Bottom 0.508: S28.S1 51.91,102.23 51.91,106.05 D25.A
N$59
  Bottom 0.508: S27.S1 51.91,83.19 51.91,87 D26.A
N$60
  Bottom 0.508: S25.S1 51.91,64.14 51.91,67.94 D27.A
N$61
  Bottom 0.508: S30.S1 70.96,102.23 70.96,106.05 D28.A
N$62
  Bottom 0.508: S29.S1 70.96,83.19 70.96,87 D29.A
N$63
  Bottom 0.508: S26.S1 70.96,64.14 70.96,67.94 D30.A
N$64  (via drill 0.33, 0.35)
  Top 0.508: v55.24,153.67 v55.24,149.07 55.24,120.02 v55.4,119.86 v55.4,100.81 55.4,81.92 v55.24,81.76 55.24,79.85 53.18,77.79 53.18,65.88 55.24,63.82 55.24,62.87 v55.4,62.71 v55.4,43.66 v55.4,28.26 v55.4,22.38
  Bottom 0.508: v55.24,149.07 55.24,144.15 D41.C | JP20.1 v55.24,153.67 | v55.4,22.38 55.4,10.79 D9.C | v55.4,28.26 55.4,29.84 D8.C | v55.4,43.66 55.4,48.9 D7.C | v55.4,62.71 55.4,67.94 D27.C | v55.24,81.76 55.24,87 D26.C | v55.4,100.81 55.4,106.05 D25.C | v55.4,119.86 55.4,125.09 D42.C
N$69
  Bottom 0.508: S34.S1 90.01,102.23 90.01,106.05 D31.A
N$70
  Bottom 0.508: S33.S1 90.01,83.19 90.01,87 D32.A
N$71
  Bottom 0.508: S31.S1 90.01,64.14 90.01,67.94 D33.A
N$72
  Bottom 0.508: S36.S1 109.06,102.23 109.06,106.05 D34.A
N$73
  Bottom 0.508: S35.S1 109.06,83.19 109.06,87 D35.A
N$74
  Bottom 0.508: S32.S1 109.06,64.14 109.06,67.94 D36.A
N$78  (via drill 0.35)
  Top 0.508: v27.3,154.31 S40.K 27.15,147.8 27.15,145.41 23.65,141.92 23.65,132.56 S39.K 27.3,126.52 23.65,122.87 23.65,113.51 S24.K 27.3,107.47 23.65,103.82 23.65,94.46 S13.K 27.3,88.42 23.65,84.77 23.65,75.41 S10.K 27.3,69.37 23.65,65.72 23.65,56.36 S8.K 27.3,50.32 23.65,46.67 23.65,37.31 S7.K 25.72,32.07 25.72,27.46 28.42,24.77 28.42,22.38 27.3,21.27 S2.K
  Bottom 0.508: JP19.1 v27.3,154.31
N$79
  Bottom 0.508: JP1.1 106.36,147.64 S48.A 103.82,150.18 85.09,150.18 84.93,150.02 | JP28.1 3.81,146.05 8.89,146.05 S38.A 13.02,150.18 27.62,150.18 27.78,150.02 | 27.78,150.02 S40.A | 46.83,150.02 46.67,150.18 27.94,150.18 27.78,150.02 | 46.83,150.02 S42.A | 65.88,150.02 65.72,150.18 46.99,150.18 46.83,150.02 | 65.88,150.02 S44.A | 84.93,150.02 84.77,150.18 66.04,150.18 65.88,150.02 | 84.93,150.02 S46.A
N$80
  Bottom 0.508: JP3.1 106.36,128.59 S47.A 104.14,127 85.41,127 85.25,127.16 | 9.05,127.16 8.89,127 3.81,127 JP30.1 | 9.05,127.16 S37.A | 28.1,127.16 27.94,127 9.21,127 9.05,127.16 | 28.1,127.16 S39.A | 47.15,127.16 46.99,127 28.26,127 28.1,127.16 | 47.15,127.16 S41.A | 66.2,127.16 66.04,127 47.31,127 47.15,127.16 | 66.2,127.16 S43.A | 85.25,127.16 85.09,127 66.36,127 66.2,127.16 | 85.25,127.16 S45.A
N$81
  Bottom 0.508: S38.S1 13.81,140.34 13.81,143.99 D37.A
N$82
  Bottom 0.508: S37.S1 13.81,121.28 13.81,125.09 D38.A
N$83
  Bottom 0.508: S40.S1 32.86,140.34 32.86,144.15 D39.A
N$84
  Bottom 0.508: S39.S1 32.86,121.28 32.86,125.09 D40.A
N$85  (via drill 0.33, 0.35)
  Top 0.508: v17.14,153.67 v17.14,149.07 16.99,148.91 16.99,136.84 15.08,134.94 15.08,123.03 17.14,120.97 17.14,120.02 v17.3,119.86 v17.3,100.81 v17.3,81.76 v17.3,62.71 v17.3,43.66 17.3,30.32 v23.02,24.61 v23.02,16.51
  Bottom 0.508: v17.14,149.07 17.14,143.99 D37.C | JP43.1 v17.14,153.67 | v23.02,16.51 17.3,10.79 D3.C | v23.02,24.61 17.78,29.84 D2.C | v17.3,43.66 17.3,48.9 D1.C | v17.3,62.71 17.3,67.94 D21.C | v17.3,81.76 17.3,87 D20.C | v17.3,100.81 17.3,106.05 D19.C | v17.3,119.86 17.3,125.09 D38.C
N$87
  Bottom 0.508: JP16.1 111.12,137.79 S48.S2 S46.S2 S44.S2 S42.S2 S40.S2 S38.S2 3.17,137.79 JP27.1
N$88
  Bottom 0.508: JP2.1 111.12,118.75 S47.S2 S45.S2 S43.S2 S41.S2 S39.S2 S37.S2 3.17,118.75 JP29.1
N$92
  Bottom 0.508: S42.S1 51.91,140.34 51.91,144.15 D41.A
N$93
  Bottom 0.508: S41.S1 51.91,121.28 51.91,125.09 D42.A
N$94
  Bottom 0.508: S44.S1 70.96,140.34 70.96,144.15 D43.A
N$95
  Bottom 0.508: S43.S1 70.96,121.28 70.96,125.09 D44.A
N$99  (via drill 0.35)
  Top 0.508: v103.5,154.31 S48.K 103.35,147.8 103.35,145.41 99.85,141.92 99.85,132.56 S47.K 103.5,126.52 99.85,122.87 99.85,113.51 S36.K 103.5,107.47 99.85,103.82 99.85,94.46 S35.K 103.5,88.42 99.85,84.77 99.85,75.41 S32.K 103.5,69.37 99.85,65.72 99.85,56.36 S23.K 103.5,50.32 99.85,46.67 99.85,30.32 100.01,30.16 | S19.K 103.5,18.73 99.85,22.38 99.85,30 100.01,30.16 | S22.K 100.01,30.16
  Bottom 0.508: JP44.1 v103.5,154.31
N$101
  Bottom 0.508: S46.S1 90.01,140.34 90.01,144.15 D45.A
N$102
  Bottom 0.508: S45.S1 90.01,121.28 90.01,125.09 D46.A
N$103
  Bottom 0.508: S48.S1 109.06,140.34 109.06,144.15 D47.A
N$104
  Bottom 0.508: S47.S1 109.06,121.28 109.06,125.09 D48.A